# Altium project atmega168a.PrjPcb
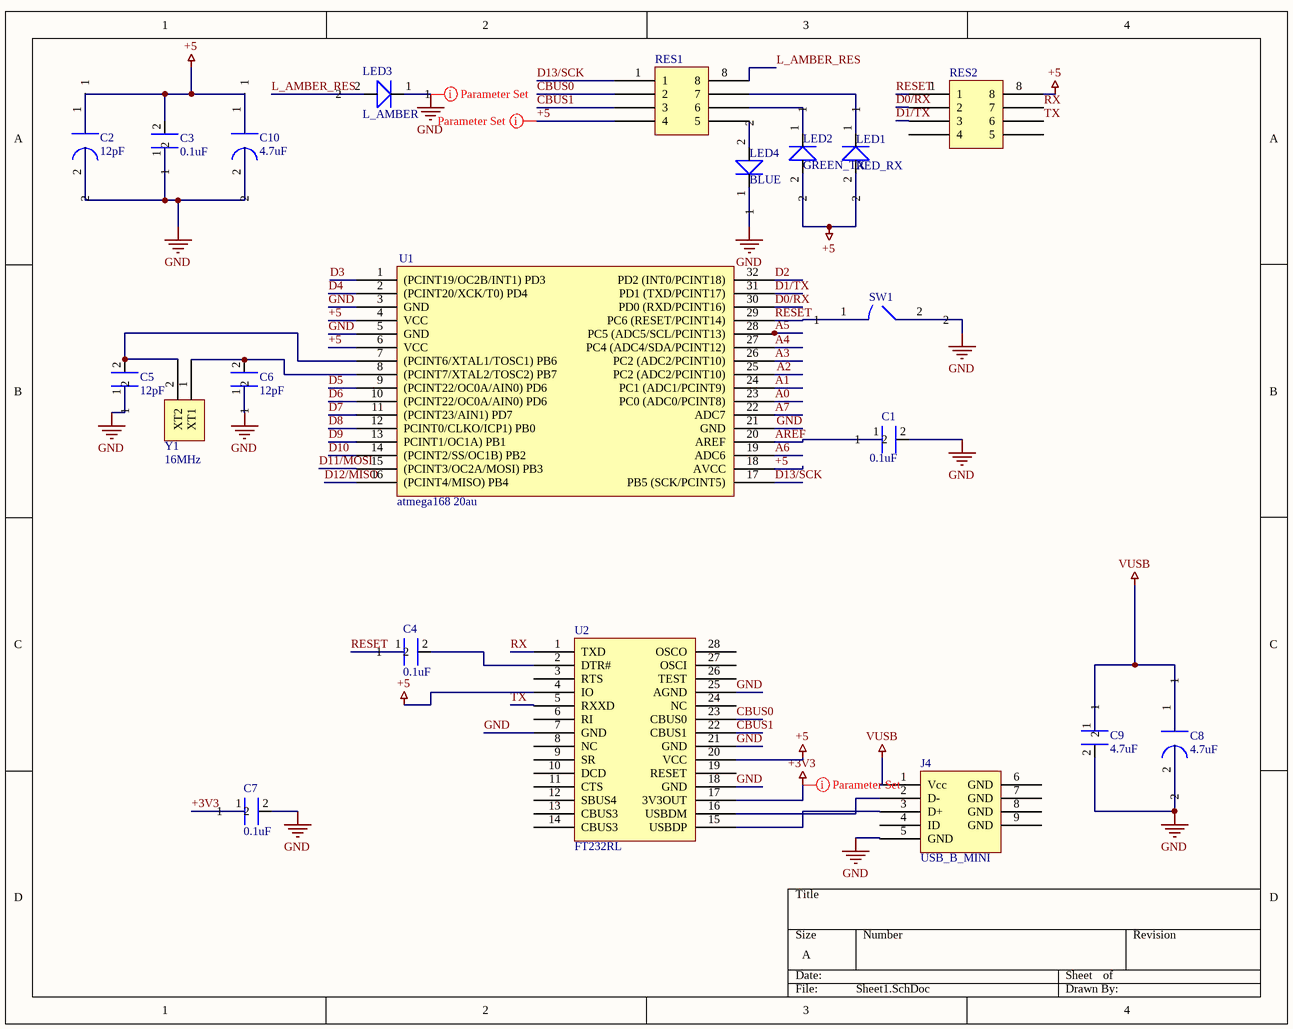
[diagram p0: Sheet1.SchDoc]
2 sheets, 27 parts. Net scope: global (net labels, ports and power ports of the same name join across sheets).
Board file: PCB1.PcbDoc
Sheets:
  Sheet1.SchDoc
  Sheet2.SchDoc

## Sheet Sheet1.SchDoc
size A; SheetNumber: 1; SheetTotal: 2

### Parts
C1  0.1uF  [Capacitor0805]
C2  12pF  [tantalum cap 7343]
C3  0.1uF  [Capacitor0805]
C4  0.1uF  [Capacitor0805]
C5  12pF  [Capacitor0805]
C6  12pF  [Capacitor0805]
C7  0.1uF  [Capacitor0805]
C8  4.7uF  [tantalum cap 7343]
C9  4.7uF  [Capacitor0805]
C10  4.7uF  [tantalum cap 7343]
J4  USB_B_MINI  [Mini B usb]
LED1  RED_RX  [LED 0805]
LED2  GREEN_TX  [LED 0805]
LED3  L_AMBER  [LED 0805]
LED4  BLUE  [LED 0805]
RES1  Component_1  [Quad 4 res array]  (value not drawn)
RES2  Component_1  [Quad 4 res array]  (value not drawn)
SW1  RESET  [switch]  (value not drawn)
U1  atmega168 20au  [Quad32]
U2  FT232RL  [Quad28 FTDI]
Y1  16MHz  [TH XT]

### Nets
+3V3: C7.1 U2.17(3V3OUT)
+5: C2.1 C3.2 C10.1 LED1.2 LED2.2 RES1.4 RES2.8 U1.4(VCC) U1.6(VCC) U1.18(AVCC) U2.4(IO) U2.20(VCC)
GND: C1.2 C2.2 C3.1 C5.1 C6.1 C7.2 C8.2 C9.2 C10.2 J4.5(GND) LED3.1 LED4.1 SW1.2 U1.3(GND) U1.5(GND) U1.21(GND) U2.7(GND) U2.18(GND) U2.21(GND) U2.25(AGND)
VUSB: C8.1 C9.1 J4.1(Vcc)
A0: U1.23(PC0_(ADC0/PCINT8))
A1: U1.24(PC1_(ADC1/PCINT9))
A2: U1.25(PC2_(ADC2/PCINT10))
A3: U1.26(PC2_(ADC2/PCINT10))
A4: U1.27(PC4_(ADC4/SDA/PCINT12))
A5: U1.28(PC5_(ADC5/SCL/PCINT13))
A6: U1.19(ADC6)
A7: U1.22(ADC7)
AREF: C1.1 U1.20(AREF)
CBUS0: RES1.2 U2.23(CBUS0)
CBUS1: RES1.3 U2.22(CBUS1)
D0/RX: RES2.2 U1.30(PD0_(RXD/PCINT16))
D1/TX: RES2.3 U1.31(PD1_(TXD/PCINT17))
D2: U1.32(PD2_(INT0/PCINT18))
D3: U1.1((PCINT19/OC2B/INT1)_PD3)
D4: U1.2((PCINT20/XCK/T0)_PD4)
D5: U1.9((PCINT22/OC0A/AIN0)_PD6)
D6: U1.10((PCINT22/OC0A/AIN0)_PD6)
D7: U1.11((PCINT23/AIN1)_PD7)
D8: U1.12(PCINT0/CLKO/ICP1)_PB0)
D9: U1.13(PCINT1/OC1A)_PB1)
D10: U1.14((PCINT2/SS/OC1B)_PB2)
D11/MOSI: U1.15((PCINT3/OC2A/MOSI)_PB3)
D12/MISO: U1.16((PCINT4/MISO)_PB4)
D13/SCK: RES1.1 U1.17(PB5_(SCK/PCINT5))
L_AMBER_RES: LED3.2 RES1.8
RESET: C4.1 RES2.1 SW1.1 U1.29(PC6_(RESET/PCINT14))
RX: RES2.7 U2.1(TXD)
TX: RES2.6 U2.5(RXXD)
NetC4_2: C4.2 U2.2(DTR#)
NetC5_2: C5.2 U1.7((PCINT6/XTAL1/TOSC1)_PB6) Y1.2(XT2)
NetC6_2: C6.2 U1.8((PCINT7/XTAL2/TOSC2)_PB7) Y1.1(XT1)
NetJ4_2: J4.2(D-) U2.16(USBDM)
NetJ4_3: J4.3(D+) U2.15(USBDP)
NetLED1_1: LED1.1 RES1.7
NetLED2_1: LED2.1 RES1.6
NetLED4_2: LED4.2 RES1.5

Not connected (* = marked no-connect by the designer): J4 4(ID) 6(GND) 7(GND) 8(GND) 9(GND); RES2 4 5; U2 3(RTS) 6(RI) 8(NC) 9(SR) 10(DCD) 11(CTS) 12(SBUS4) 13(CBUS3) 14(CBUS3) 19(RESET) 24(NC) 26(TEST) 27(OSCI) 28(OSCO)

### Layout directives
rule Width Constraint [Pref Width = 0.3mm    Min Width = 0.3mm    Max Width = 0.3mm]: +3V3, +5, GND

### Library data of the parts
C1-C10 J4 LED1-LED4 SW1 U2 Y1 = Component_1

## Sheet Sheet2.SchDoc
size A; SheetNumber: 2; SheetTotal: 2
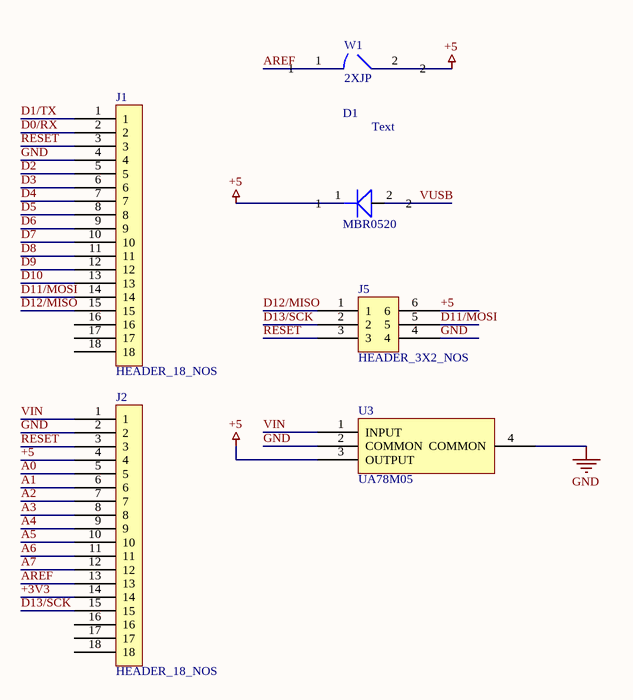
[diagram p1: Sheet2.SchDoc]

### Parts
D1  MBR0520  [shotkey diode sod962]
J1  HEADER_18_NOS  [DIP18]
J2  HEADER_18_NOS  [DIP18]
J5  HEADER_3X2_NOS  [DIP6]
U3  UA78M05  [SOT223-4]
W1  2XJP  [switch]

### Nets
+3V3: J2.14
+5: D1.1 J2.4 J5.6 U3.3(OUTPUT) W1.2
GND: J1.4 J2.2 J5.4 U3.2(COMMON) U3.4(COMMON)
VUSB: D1.2
A0: J2.5
A1: J2.6
A2: J2.7
A3: J2.8
A4: J2.9
A5: J2.10
A6: J2.11
A7: J2.12
AREF: J2.13 W1.1
D0/RX: J1.2
D1/TX: J1.1
D2: J1.5
D3: J1.6
D4: J1.7
D5: J1.8
D6: J1.9
D7: J1.10
D8: J1.11
D9: J1.12
D10: J1.13
D11/MOSI: J1.14 J5.5
D12/MISO: J1.15 J5.1
D13/SCK: J2.15 J5.2
RESET: J1.3 J2.3 J5.3
VIN: J2.1 U3.1(INPUT)

Not connected (* = marked no-connect by the designer): J1 16 17 18; J2 16 17 18

### Notes on the sheet
- (in symbol Component_1) Text

### Library data of the parts
D1 J1 J2 J5 U3 W1 = Component_1

## Nets that join several sheets
+3V3: Sheet1 (C7.1 U2.17), Sheet2 (J2.14)
+5: Sheet1 (12 pins), Sheet2 (5 pins)
GND: Sheet1 (20 pins), Sheet2 (5 pins)
VUSB: Sheet1 (C8.1 C9.1 J4.1), Sheet2 (D1.2)
A0: Sheet1 (U1.23), Sheet2 (J2.5)
A1: Sheet1 (U1.24), Sheet2 (J2.6)
A2: Sheet1 (U1.25), Sheet2 (J2.7)
A3: Sheet1 (U1.26), Sheet2 (J2.8)
A4: Sheet1 (U1.27), Sheet2 (J2.9)
A5: Sheet1 (U1.28), Sheet2 (J2.10)
A6: Sheet1 (U1.19), Sheet2 (J2.11)
A7: Sheet1 (U1.22), Sheet2 (J2.12)
AREF: Sheet1 (C1.1 U1.20), Sheet2 (J2.13 W1.1)
D0/RX: Sheet1 (RES2.2 U1.30), Sheet2 (J1.2)
D1/TX: Sheet1 (RES2.3 U1.31), Sheet2 (J1.1)
D2: Sheet1 (U1.32), Sheet2 (J1.5)
D3: Sheet1 (U1.1), Sheet2 (J1.6)
D4: Sheet1 (U1.2), Sheet2 (J1.7)
D5: Sheet1 (U1.9), Sheet2 (J1.8)
D6: Sheet1 (U1.10), Sheet2 (J1.9)
D7: Sheet1 (U1.11), Sheet2 (J1.10)
D8: Sheet1 (U1.12), Sheet2 (J1.11)
D9: Sheet1 (U1.13), Sheet2 (J1.12)
D10: Sheet1 (U1.14), Sheet2 (J1.13)
D11/MOSI: Sheet1 (U1.15), Sheet2 (J1.14 J5.5)
D12/MISO: Sheet1 (U1.16), Sheet2 (J1.15 J5.1)
D13/SCK: Sheet1 (RES1.1 U1.17), Sheet2 (J2.15 J5.2)
RESET: Sheet1 (C4.1 RES2.1 SW1.1 U1.29), Sheet2 (J1.3 J2.3 J5.3)